# Altium schematic sheet L1_Power.SchDoc
size 551 x 266 mm; SheetNumber: 1; SheetTotal: 1; PageSetup: Record=PageOptions|CenterHorizontal=False|CenterVertical=False|PrintScale=0.70|XCorrection=1.00|YCorrection=1.00|PrintKind=0|BorderSize=5000000|LeftOffset=0|BottomOffset=0|Orientation=2|PaperLength=1000|PaperWidth=1000|Scale=100|PaperSource=7|PrintQuality=-3|MediaType=1|DitherType=10|PrintScaleMode=1|PaperKind=A3|PaperIndex=8
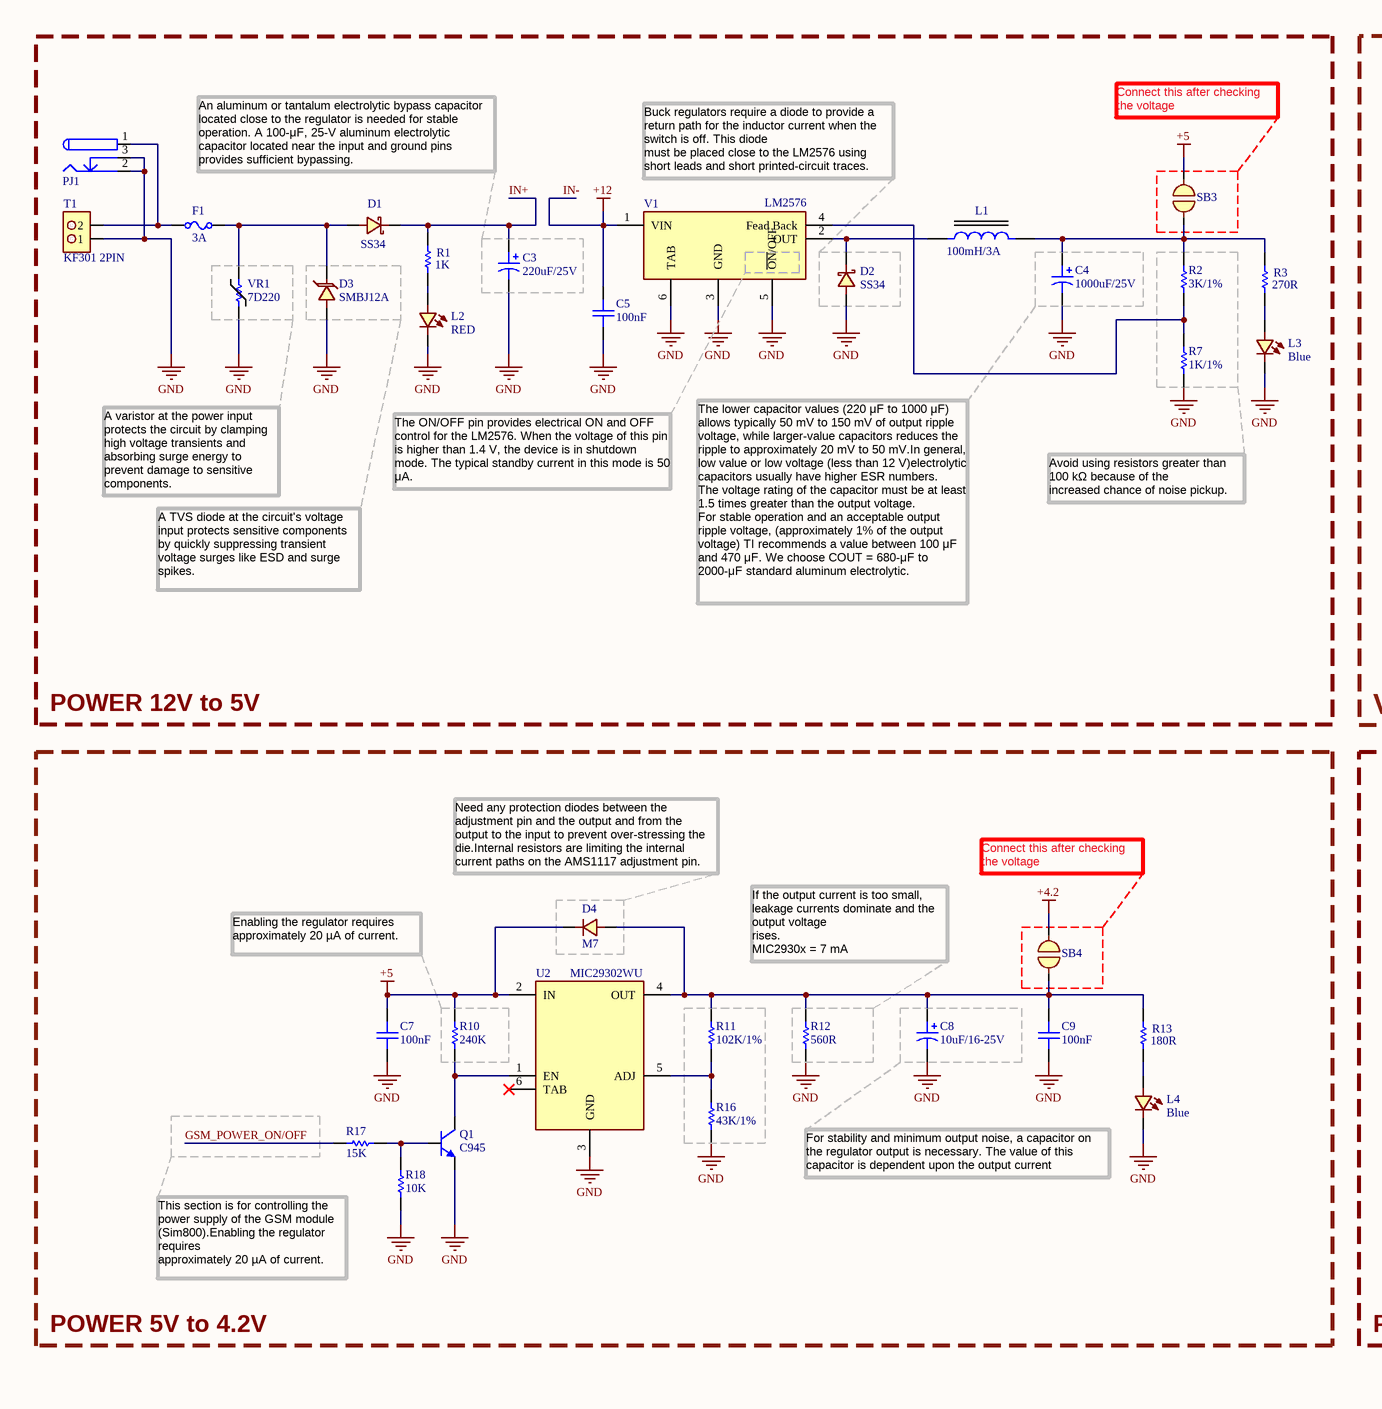
[diagram p0: L1_Power.SchDoc, left]
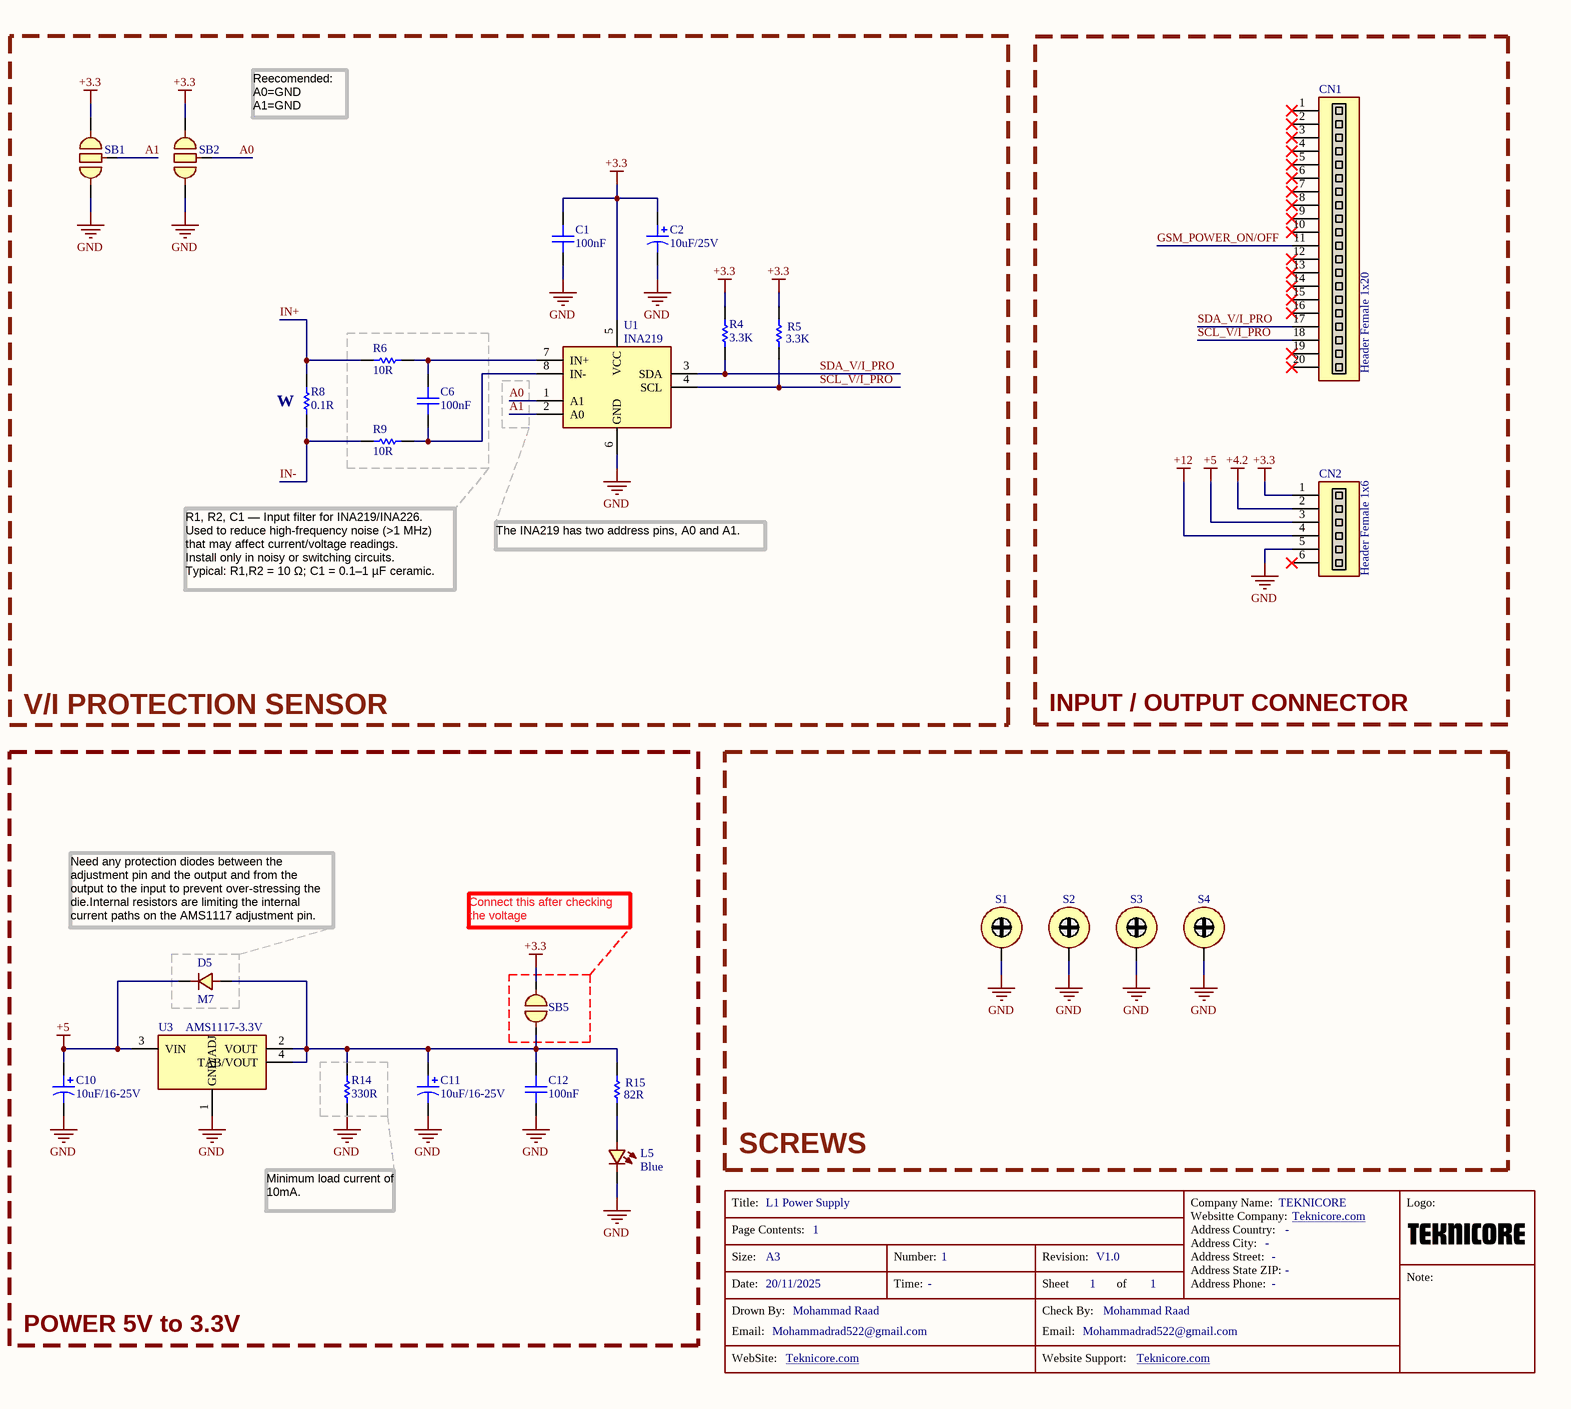
[diagram p1: L1_Power.SchDoc, right]

## Parts
(Parts that share a designator on the sheet are numbered #1, #2 ... from top to bottom, then left to right.)
C1  100nF  [CAP1206]
C2  10uF/25V  [CAP_EL_0810]
C3  220uF/25V  [CAP_EL_0810]
C4  1000uF/25V  [CAP_EL_1010]
C5  100nF  [CAP1206]
C6  100nF  [CAP1206]
C7  100nF  [CAP1206]
C8  10uF/16-25V  [Cap_TA_A]
C9  100nF  [CAP1206]
C10  10uF/16-25V  [Cap_TA_A]
C11  10uF/16-25V  [Cap_TA_A]
C12  100nF  [CAP1206]
CN1  Header Female 1x20  [HDR_F_1x20PIN_0.2"]
CN2  Header Female 1x6  [HDR_F_1x6PIN_0.2"]
D1  SS34  [Diode DO-214AB SMC]
D2  SS34  [Diode DO-214AB SMC]
D3  SMBJ12A  [Diode DO-214AA SMB]
D4  M7  [Diode DO-214AC SMA]
D5  M7  [Diode DO-214AC SMA]
F1  3A  [Fuse_2410]
L1  100mH/3A  [IND_RH127]
L2  RED  [LED 1206]
L3  Blue  [LED 1206]
L4  Blue  [LED 1206]
L5  Blue  [LED 1206]
PJ1  Power Jack.  [Power Jack.]  (value not drawn)
Q1  C945  [SOT23_M]
R1  1K  [Resistor_SMD_1206]
R2  3K/1%  [Resistor_SMD_1206]
R3  270R  [Resistor_SMD_1206]
R4  3.3K  [Resistor_SMD_1206]
R5  3.3K  [Resistor_SMD_1206]
R6  10R  [Resistor_SMD_1206]
R7  1K/1%  [Resistor_SMD_1206]
R8  0.1R  [RESISTOR_SMD_2512]
R9  10R  [Resistor_SMD_1206]
R10  240K  [Resistor_SMD_1206]
R11  102K/1%  [Resistor_SMD_1206]
R12  560R  [Resistor_SMD_1206]
R13  180R  [Resistor_SMD_1206]
R14  330R  [Resistor_SMD_1206]
R15  82R  [Resistor_SMD_1206]
R16  43K/1%  [Resistor_SMD_1206]
R17  15K  [Resistor_SMD_1206]
R18  10K  [Resistor_SMD_1206]
S1  Screw  [Screw 3mm-Invirons 0.254mm]  (value not drawn)
S2  Screw  [Screw 3mm-Invirons 0.254mm]  (value not drawn)
S3  Screw  [Screw 3mm-Invirons 0.254mm]  (value not drawn)
S4  Screw  [Screw 3mm-Invirons 0.254mm]  (value not drawn)
SB1  Solder Bridge  [SolderBridge_Small_NC_3Pin (70x50)(20)mil]  (value not drawn)
SB2  Solder Bridge  [SolderBridge_Small_NC_3Pin (70x50)(20)mil]  (value not drawn)
SB3  Solder Bridge  [SolderBridge_Small_NC (70x50)(20)mil]  (value not drawn)
SB4  Solder Bridge  [SolderBridge_Small_NC (70x50)(20)mil]  (value not drawn)
SB5  Solder Bridge  [SolderBridge_Small_NC (70x50)(20)mil]  (value not drawn)
T1#1  KF301 2PIN  [KF301 2Pin Mini]
T1#2  Title: L1 Power Supply  Page Conteents: 1  Size: A3  Drawn By: Mohammad Raad  Drown By (Email): Mohammadrad522@gmail.com  Website: Teknicore.com  Date: 20/11/2025  Reversion: V1.0  Company Name: TEKNICORE  (hidden comment: Title Block)  (graphical)
U1  INA219  [SOIC8]
U2  MIC29302WU  [TO263]
U3  AMS1117-3.3V  [SOT229]
V1  LM2576  [TO263]
VR1  7D220  [Varistor 07DXXX]

## Blocks framed on the sheet
POWER 12V to 5V: C3-C5 D1-D3 F1 L1-L3 PJ1 R1-R3 R7 SB3 T1#1 V1 VR1
V/I PROTECTION SENSOR: C1 C2 C6 R4-R6 R8 R9 SB1 SB2 U1
INPUT / OUTPUT CONNECTOR: CN1 CN2
POWER 5V to 4.2V: C7-C9 D4 L4 Q1 R10-R13 R16-R18 SB4 U2
POWER 5V to 3.3V: C10-C12 D5 L5 R14 R15 SB5 U3
SCREWS: S1-S4

## Nets
+3.3: C1.1 C2.1 CN2.1 R4.2 R5.2 SB1.3 SB2.3 SB5.2 U1.5(VCC)
+4.2: CN2.2 SB4.2
+5: C7.2 C10.1 CN2.3 D4.2(K) D5.2(K) R10.2 SB3.2 U2.2(IN) U3.3(VIN)
GND: C1.2 C2.2 C3.2 C4.2 C5.2 C7.1 C8.2 C9.1 C10.2 C11.2 C12.2 CN2.5 D2.1(A) D3.1(A) L2.K L3.K L4.K L5.K PJ1.2 PJ1.3 Q1.2(E) R7.1 R12.1 R14.1 R16.1 R18.1 S1.S S2.S S3.S S4.S SB1.1 SB2.1 T1#1.1 U1.6(GND) U2.3(GND) U3.1(GND/ADJ) V1.3(GND) V1.5(~{ON}/OFF) V1.6(TAB) VR1.1
IN-: C5.1 CN2.4 R8.1 R9.1 V1.1(VIN)  [also labelled +12]
A0: SB2.2 U1.1(A1)
A1: SB1.2 U1.2(A0)
GSM_POWER_ON/OFF: CN1.11 R17.1
IN+: C3.1 D1.2(K) R1.2 R6.1 R8.2
SCL_V/I_PRO: CN1.18 R5.1 U1.4(SCL)
SDA_V/I_PRO: CN1.17 R4.1 U1.3(SDA)
NetC4_1: C4.1 L1.2 R2.2 R3.2 SB3.1
NetC6_1: C6.1 R6.2 U1.7(IN+)
NetC6_2: C6.2 R9.2 U1.8(IN-)
NetC8_1: C8.1 C9.2 D4.1(A) R11.2 R12.2 R13.2 SB4.1 U2.4(OUT)
NetC11_1: C11.1 C12.1 D5.1(A) R14.2 R15.2 SB5.1 U3.2(VOUT) U3.4(TAB/VOUT)
NetD1_1: D1.1(A) D3.2(K) F1.2 VR1.2
NetD2_2: D2.2(K) L1.1 V1.2(OUT)
NetF1_1: F1.1 PJ1.1 T1#1.2
NetL2_A: L2.A R1.1
NetL3_A: L3.A R3.1
NetL4_A: L4.A R13.1
NetL5_A: L5.A R15.1
NetQ1_1: Q1.1(B) R17.2 R18.2
NetQ1_3: Q1.3(C) R10.1 U2.1(EN)
NetR2_1: R2.1 R7.2 V1.4(Fead_Back)
NetR11_1: R11.1 R16.2 U2.5(ADJ)

Not connected (* = marked no-connect by the designer): CN1 1* 2* 3* 4* 5* 6* 7* 8* 9* 10* 12* 13* 14* 15* 16* 19* 20*; CN2 6*; U2 6(TAB)*

## Notes on the sheet
- Connect this after checking the voltage
- Reecomended:
  A0=GND
  A1=GND
- An aluminum or tantalum electrolytic bypass capacitor located close to the regulator is needed for stable
  operation. A 100-μF, 25-V aluminum electrolytic capacitor located near the input and ground pins provides sufficient bypassing.
- (near V1) Buck regulators require a diode to provide a return path for the inductor current when the switch is off. This diode
  must be placed close to the LM2576 using short leads and short printed-circuit traces.
- (near R8) W
- The ON/OFF pin provides electrical ON and OFF control for the LM2576. When the voltage of this pin is higher than 1.4 V, the device is in shutdown mode. The typical standby current in this mode is 50 μA.
- A varistor at the power input protects the circuit by clamping high voltage transients and absorbing surge energy to prevent damage to sensitive components.
- Avoid using resistors greater than 100 kΩ because of the
  increased chance of noise pickup.
- The INA219 has two address pins, A0 and A1.
- A TVS diode at the circuit's voltage input protects sensitive components by quickly suppressing transient voltage surges like ESD and surge spikes.
- The lower capacitor values (220 μF to 1000 μF) allows typically 50 mV to 150 mV of output ripple voltage, while larger-value capacitors reduces the ripple to approximately 20 mV to 50 mV.In general, low value or low voltage (less than 12 V)electrolytic capacitors usually have higher ESR numbers.
  The voltage rating of the capacitor must be at least 1.5 times greater than the output voltage.
  For stable operation and an acceptable output ripple voltage, (approximately 1% of the output
  voltage) TI recommends a value between 100 μF and 470 μF. We choose COUT = 680-μF to 2000-μF standard aluminum electrolytic.
- R1, R2, C1 — Input filter for INA219/INA226.
  Used to reduce high-frequency noise (>1 MHz) that may affect current/voltage readings.
  Install only in noisy or switching circuits.
  Typical: R1,R2 = 10 Ω; C1 = 0.1–1 µF ceramic.
- Need any protection diodes between the adjustment pin and the output and from the output to the input to prevent over-stressing the die.Internal resistors are limiting the internal current paths on the AMS1117 adjustment pin.
- Enabling the regulator requires
  approximately 20 µA of current.
- If the output current is too small,
  leakage currents dominate and the output voltage
  rises.
  MIC2930x = 7 mA
- (near L4) For stability and minimum output noise, a capacitor on
  the regulator output is necessary. The value of this
  capacitor is dependent upon the output current
- Minimum load current of 10mA.
- This section is for controlling the power supply of the GSM module (Sim800).Enabling the regulator requires
  approximately 20 µA of current.
- (in symbol Title Block) Title:; Company Name:; Logo:; Websitte Company:; Page Contents:; Address Country:; Address City:; Size:; Number:; Revision:; Address Street:; Address State ZIP:; Note:; Date:; Time:; Sheet; of; Address Phone:; Drown By:; Check By:; Email:; WebSite:; Website Support:

## Library data of the parts
C1 C5-C7 C9 C12 = Capacitor Poliester & Ceramic
C2-C4 = Capacitor Electorolytic
C8 C10 C11 = Capacitor Tantalum
D1 D2 = Schottky Diode
D3 = TVS Diode
D4 D5 = Diode: Surface Mount General Rectifier * Plastic Passivation Junction / Reverse Voltage -50 to 1000 Volts * Forward Current -1.0 Ampere / VTR-H Diode M1 thru M7
F1 = Fuse: Fuses
L1 = Inductor
L2-L5 = LED
Q1 = C945: NPN Silicon Epitaxial Planar Transistor
R1-R18 = Resistor
SB1 SB2 = Solder Bridge Short 3Pin (NC): Solder Bridge Jumper
SB3-SB5 = Solder Bridge Short (NC)
T1#1 = Terminal 2PIN
U1 = INA219: INA219 Zerø-Drift, Bidirectional Current/Power Monitor With I / 2C Interface
U2 = MIC29XXX: High-Current Low Dropout Regulators
U3 = AMS1117: Sot223/Pkg 1-Amp Low Drop Out Voltage Regulatator
V1 = LM2576: LM2576xx Series SIMPLE SWITCHER® Power Converter 3-A Step-Down Voltage / Regulator
VR1 = Varistor
T1#2 = Title Block: Number Sheet: 1; This Sheet Number: 1; All Sheet Number: 1; Checked By: Mohammad Raad; Checked By (Email): Mohammadrad522@gmail.com; Website Support: Teknicore.com; Website Company: Teknicore.com; Address Country: -; Address City: -; Address Country Street: -; Address State ZIP: -; Address Phone: -; Time:: -